# Altium schematic sheet DS12c887.SchDoc
size A4
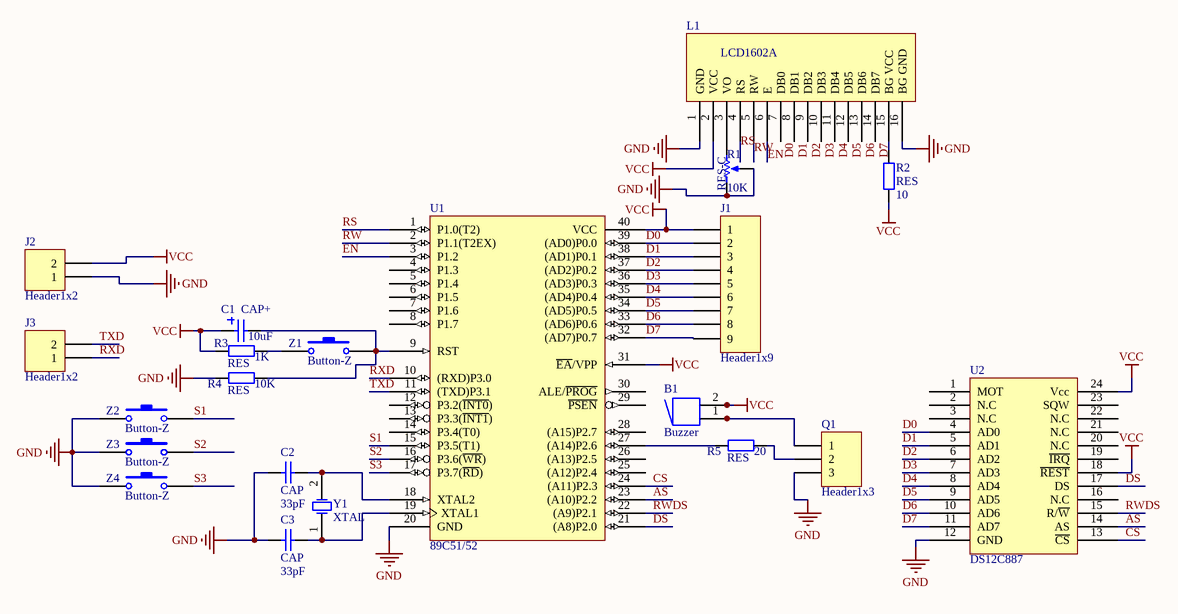
[diagram p0: DS12c887.SchDoc]

## Parts
B1  Buzzer  [BUZZER]
C1  CAP+  [CAP+DIP]
C2  CAP  [CAP]
C3  CAP  [CAP]
J1  Header1x9  [HEADER1X9]
J2  Header1x2  [HEADER1X2]
J3  Header1x2  [HEADER1X2]
L1  LCD1602A  [LCD1602A]
Q1  Header1x3  [HEADER1X3]
R1  RES-C  [RES-Change-T]
R2  RES  [RES]
R3  RES  [RES]
R4  RES  [RES]
R5  RES  [RES]
U1  89C51/52  [DIP-40]
U2  DS12C887  [DIP-24]
Y1  XTAL  [XTAL]
Z1  Button-Z  [SW-PB-Z]
Z2  Button-Z  [SW-PB-Z]
Z3  Button-Z  [SW-PB-Z]
Z4  Button-Z  [SW-PB-Z]

## Nets
GND: C2.2 C3.2 J2.1 L1.1(GND) L1.16(BG_GND) Q1.3 R1.1(TOP) R1.3(TAP) R4.1 U1.20(GND) U2.12(GND) Z2.1 Z3.1 Z4.1
VCC: B1.2 C1.1 J1.1 J2.2 L1.2(VCC) R2.1 R3.2 U1.31(~{EA}/VPP) U1.40(VCC) U2.18(~{REST}) U2.24(Vcc)
AS: U1.23((A10)P2.2) U2.14(AS)
CS: U1.24((A11)P2.3) U2.13(~{CS})
D0: J1.2 L1.7(DB0) U1.39((AD0)P0.0) U2.4(AD0)
D1: J1.3 L1.8(DB1) U1.38((AD1)P0.1) U2.5(AD1)
D2: J1.4 L1.9(DB2) U1.37((AD2)P0.2) U2.6(AD2)
D3: J1.5 L1.10(DB3) U1.36((AD3)P0.3) U2.7(AD3)
D4: J1.6 L1.11(DB4) U1.35((AD4)P0.4) U2.8(AD4)
D5: J1.7 L1.12(DB5) U1.34((AD5)P0.5) U2.9(AD5)
D6: J1.8 L1.13(DB6) U1.33((AD6)P0.6) U2.10(AD6)
D7: J1.9 L1.14(DB7) U1.32((AD7)P0.7) U2.11(AD7)
DS: U1.21((A8)P2.0) U2.17(DS)
EN: L1.6(E) U1.3(P1.2)
RS: L1.4(RS) U1.1(P1.0(T2))
RW: L1.5(RW) U1.2(P1.1(T2EX))
RWDS: U1.22((A9)P2.1) U2.15(R/~{W})
RXD: J3.1 U1.10((RXD)P3.0)
S1: U1.15(P3.5(T1)) Z2.2
S2: U1.16(P3.6(~{WR})) Z3.2
S3: U1.17(P3.7(~{RD})) Z4.2
TXD: J3.2 U1.11((TXD)P3.1)
NetB1_1: B1.1 Q1.1
NetC1_2: C1.2 R4.2 U1.9(RST) Z1.2
NetC2_1: C2.1 U1.18(XTAL2) Y1.2(OSC2)
NetC3_1: C3.1 U1.19(XTAL1) Y1.1(OSC1)
NetL1_3: L1.3(VO) R1.2(BOT)
NetL1_15: L1.15(BG_VCC) R2.2
NetQ1_2: Q1.2 R5.2
NetR3_1: R3.1 Z1.1
NetR5_1: R5.1 U1.27((A14)P2.6)

Not connected (* = marked no-connect by the designer): U1 4(P1.3) 5(P1.4) 6(P1.5) 7(P1.6) 8(P1.7) 12(P3.2(~{INT0})) 13(P3.3(~{INT1})) 14(P3.4(T0)) 25((A12)P2.4) 26((A13)P2.5) 28((A15)P2.7) 29(~{PSEN}) 30(ALE/~{PROG}); U2 1(MOT) 2(N.C) 3(N.C) 16(N.C) 19(~{IRQ}) 20(N.C) 21(N.C) 22(N.C) 23(SQW)

## Notes on the sheet
- (in symbol CAP) 33pF
- (in symbol CAP+DIP) 10uF
- (in symbol RES) 10K; 1K; 10; 20
- (in symbol RES-Change-T) 10K

## Library data of the parts
C1 = CAP+DIP
R1 = RES-Change-T
Z1-Z4 = SW-Button-Z